# EasyEDA Pro project 调参板V3.eprj

# Schematic Schematic1
Create Date: 2024-02-26; Page Name: P1; Project Name: 调参板V3; Schematic Name: Schematic1; Update Date: 2024-02-26; Company: 嘉立创EDA; Page Size: A4; Version: V1.0
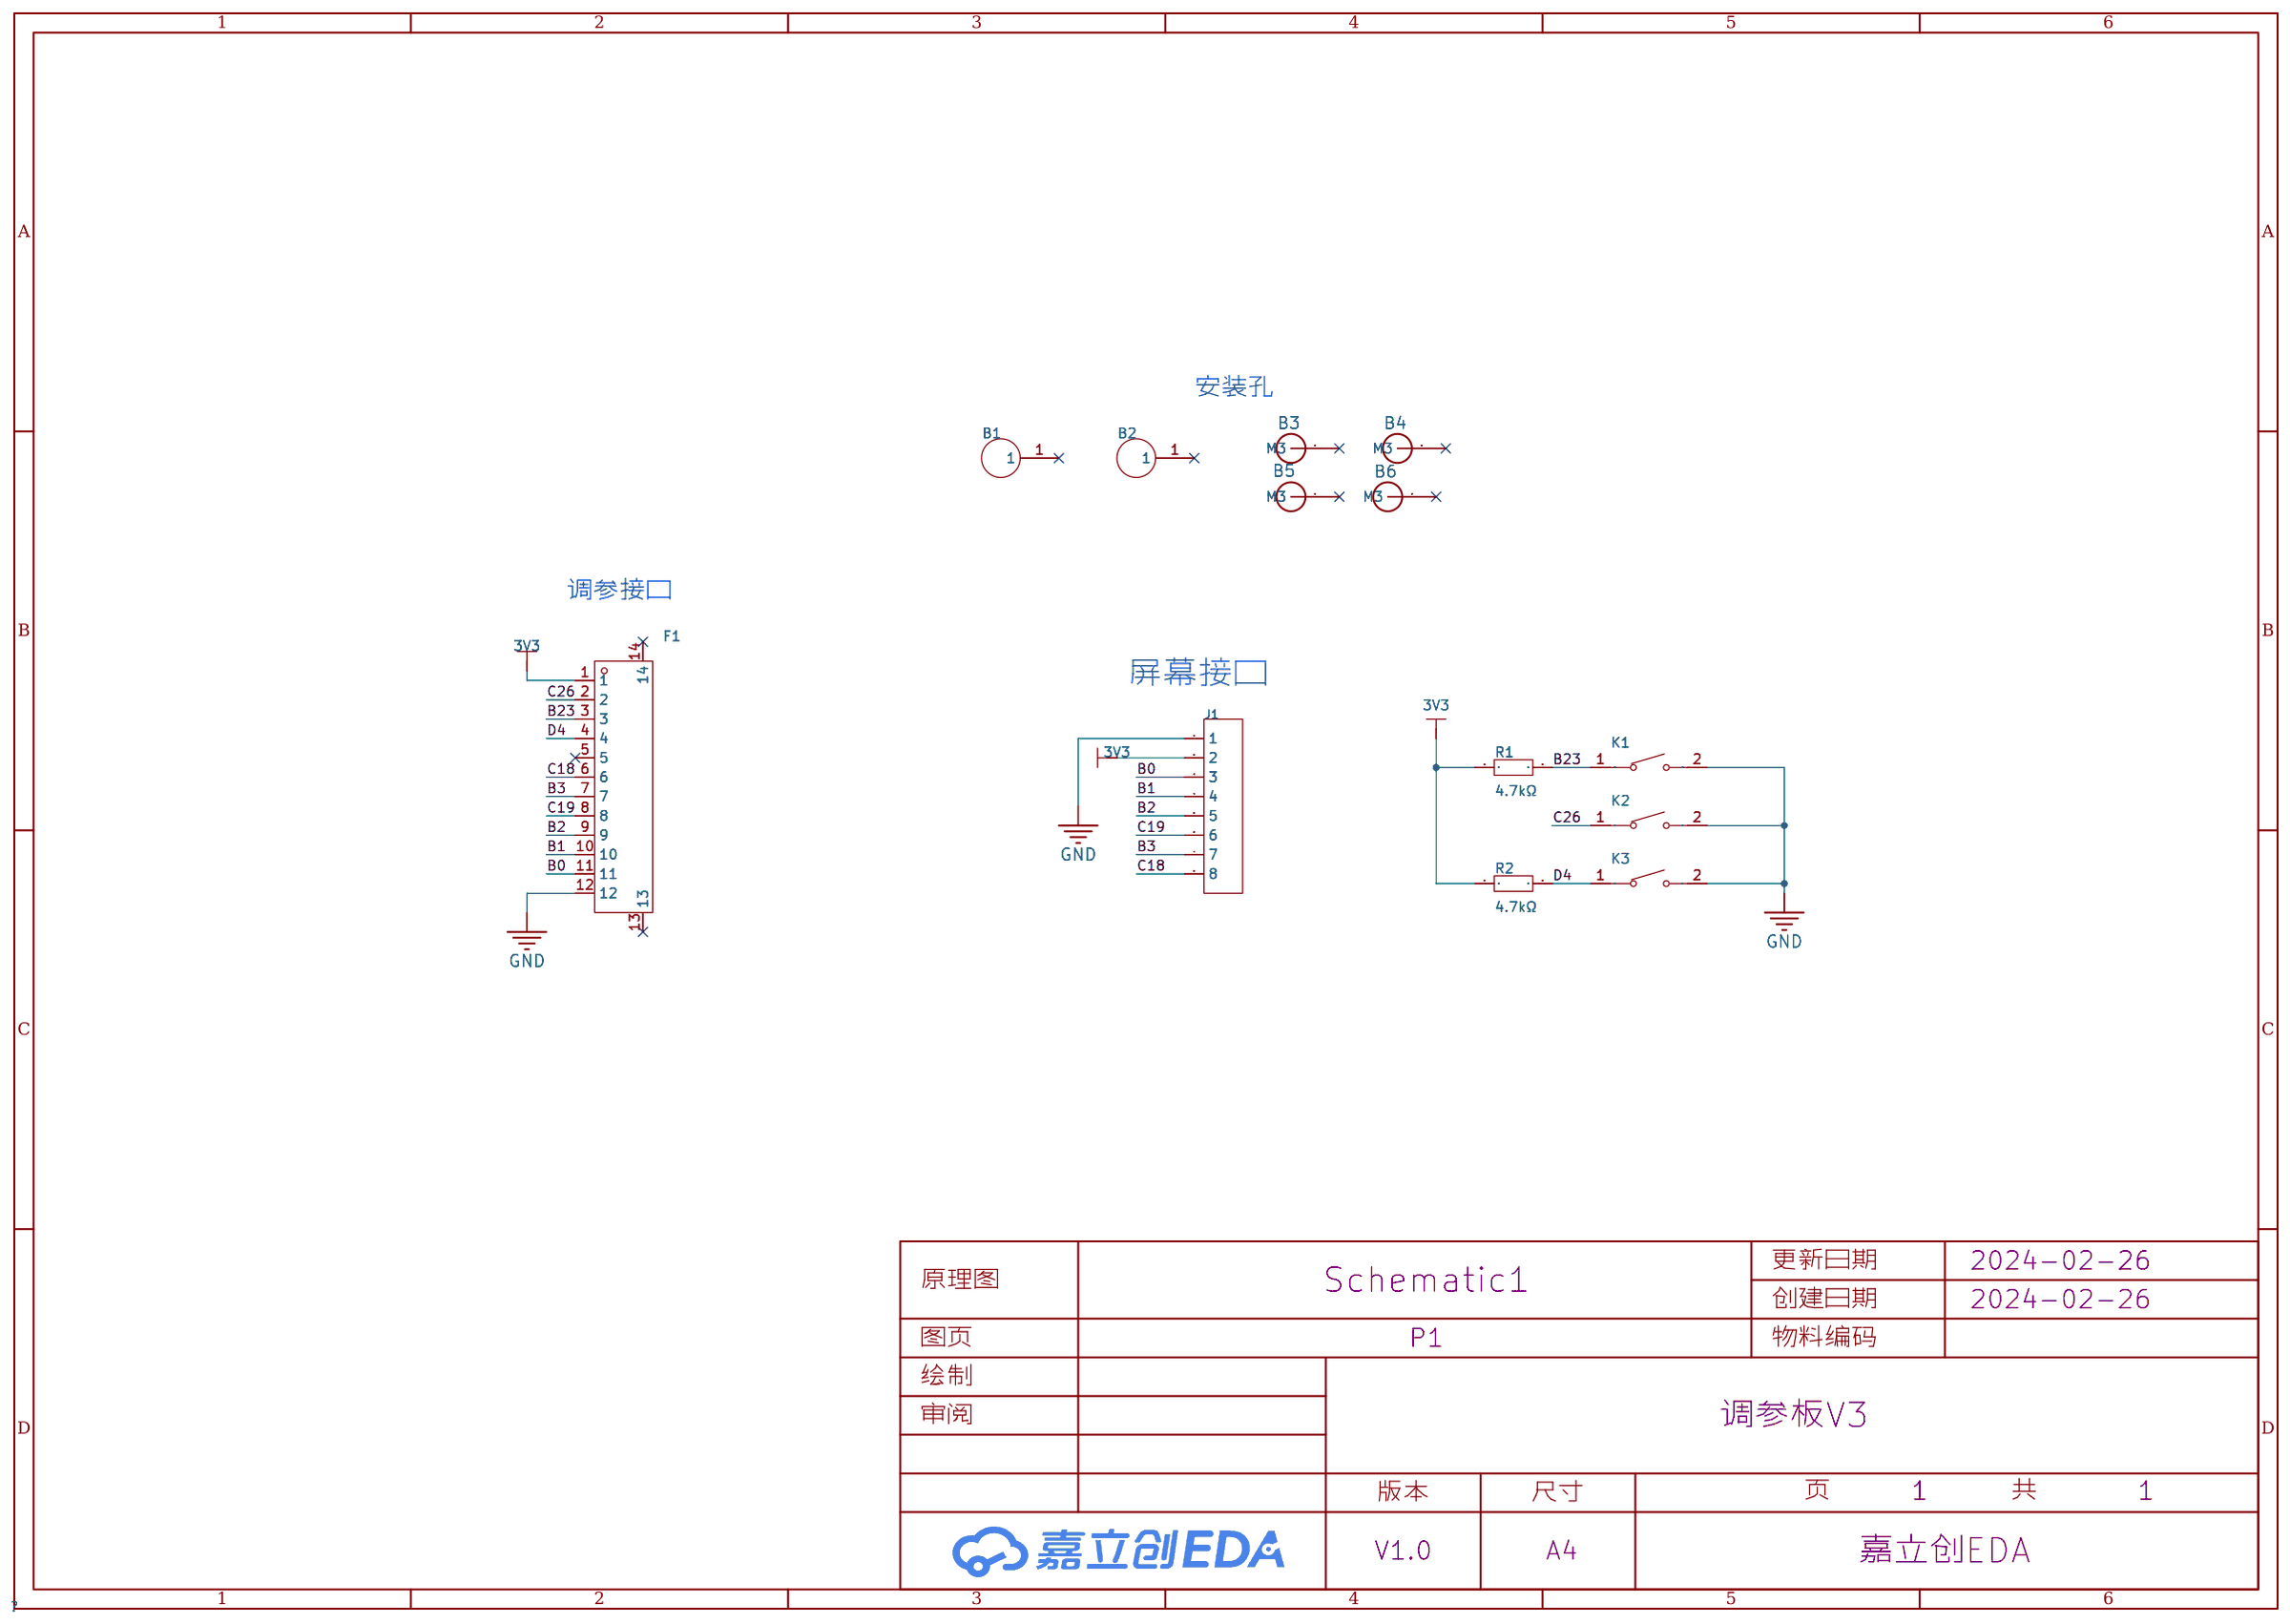
[diagram p0: schematic sheet]

## Parts
B1  -  [M2]
B2  -  [M2]
B3  M3螺柱孔_JX  [M3]
B4  M3螺柱孔_JX  [M3]
B5  M3螺柱孔_JX  [M3]
B6  M3螺柱孔_JX  [M3]
F1  FPC-1.0FX-12PWCR-H20  [FPC-SMD_XUNPU_FPC-1.0FX-12PWCR-H20]
J1  -  [HDR-TH_8P-P2.54-V-F-1]
K1  TS665WS 250gf  [SW-SMD_L6.0-W6.0-LS6.6]
K2  TS665WS 250gf  [SW-SMD_L6.0-W6.0-LS6.6]
K3  TS665WS 250gf  [SW-SMD_L6.0-W6.0-LS6.6]
R1  4.7kΩ  [R0603]
R2  4.7kΩ  [R0603]

## Library data of the parts
B1 B2 = M2
B3-B6 = M3螺柱孔_JX
F1 = FPC-1.0FX-12PWCR-H20: 锁定特性:翻盖式;触点类型:下接;触点数量:12P;间距:1mm;安装类型:卧贴;; LCSC Part Name: 间距:1mm P数:12P 翻盖式 下接; Supplier Part: C19269355; Manufacturer: XUNPU(讯普); Supplier Footprint: SMD,P=1mm,卧贴; Datasheet: https://atta.szlcsc.com/upload/public/pdf/source/20231121/46D1D420E162B395A0FFF09C3BB98E72.pdf; Supplier: LCSC; Locking Feature: 翻盖式; Contact Type: 下接; Number of Contacts: 12P; Pitch: 1mm; Mounting Type: 卧贴; Height Above Board: 2mm
J1 = HDR-F_2.54_1x8P: Supplier Part: C27438; Supplier Footprint: 插件
K1-K3 = TS665WS 250gf: 电路结构:单刀单掷;按钮形状:圆形按钮;作用力:250gf;安装方式:立贴;开关长度:6mm;开关宽度:6mm;开关高度:5mm;带支架:不带;触点电流:50mA;额定电压(DC):12V;额定功率:0.6W;绝缘电阻:100MΩ;带灯:无;机械寿命:10万次;; LCSC Part Name: 无声按键开关 6*6*5mm 250G; Supplier Part: C6798384; Manufacturer: SHOU HAN(首韩); Supplier Footprint: SMD; JLCPCB Part Class: 扩展库; Datasheet: https://atta.szlcsc.com/upload/public/pdf/source/20230621/9BA9DAAFF61506696103CF7691F2BF59.pdf; Supplier: LCSC; Circuit: 单刀单掷; Actuator Style: 圆形按钮; Operating Force: 250gf; Mounting Style: 立贴; Switch Length: 6mm; Switch Width: 6mm; Switch Height: 5mm; Strike Gundam: 不带; Contact Current: 50mA; Voltage Rating (DC): 12V; Power Rating: 0.6W; Insulation Resistance: 100MΩ; Actuator/Cap Color: 黑色; With Lamp: 无; Mechanical Life: 10万次; Operating Temperature: -40℃~+80℃
R1 R2 = 0603WAF4701T5E: 电阻类型:厚膜电阻;阻值:4.7kΩ;精度:±1%;功率:100mW;最大工作电压:75V;温度系数:±100ppm/℃;; LCSC Part Name: 4.7kΩ ±1% 100mW 厚膜电阻; Supplier Part: C23162; Manufacturer: UNI-ROYAL(厚声); Supplier Footprint: 0603; JLCPCB Part Class: 基础库; Datasheet: https://atta.szlcsc.com/upload/public/pdf/source/20200306/C422600_1E6D84923E4A46A82E41ADD87F860B5C.pdf; Supplier: LCSC; Type: 厚膜电阻; Tolerance: ±1%; Power(Watts): 100mW; Overload Voltage (Max): 75V; Temperature Coefficient: ±100ppm/℃; Operating Temperature Range: -55℃~+155℃

## Nets
3V3: F1.1 J1.2 R1.1 R2.1
GND: F1.12 J1.1 K1.2(B) K2.2(B) K3.2(B)
B0: F1.11 J1.3
B1: F1.10 J1.4
B2: F1.9 J1.5
B3: F1.7 J1.7
B23: F1.3 K1.1(A) R1.2
C18: F1.6 J1.8
C19: F1.8 J1.6
C26: F1.2 K2.1(A)
D4: F1.4 K3.1(A) R2.2

Not connected (* = marked no-connect by the designer): B1 1*; B2 1*; B3 1(M3)*; B4 1(M3)*; B5 1(M3)*; B6 1(M3)*; F1 5* 13* 14*

## Notes on the sheet
- 安装孔
- 调参接口
- 屏幕接口

# Board PCB1
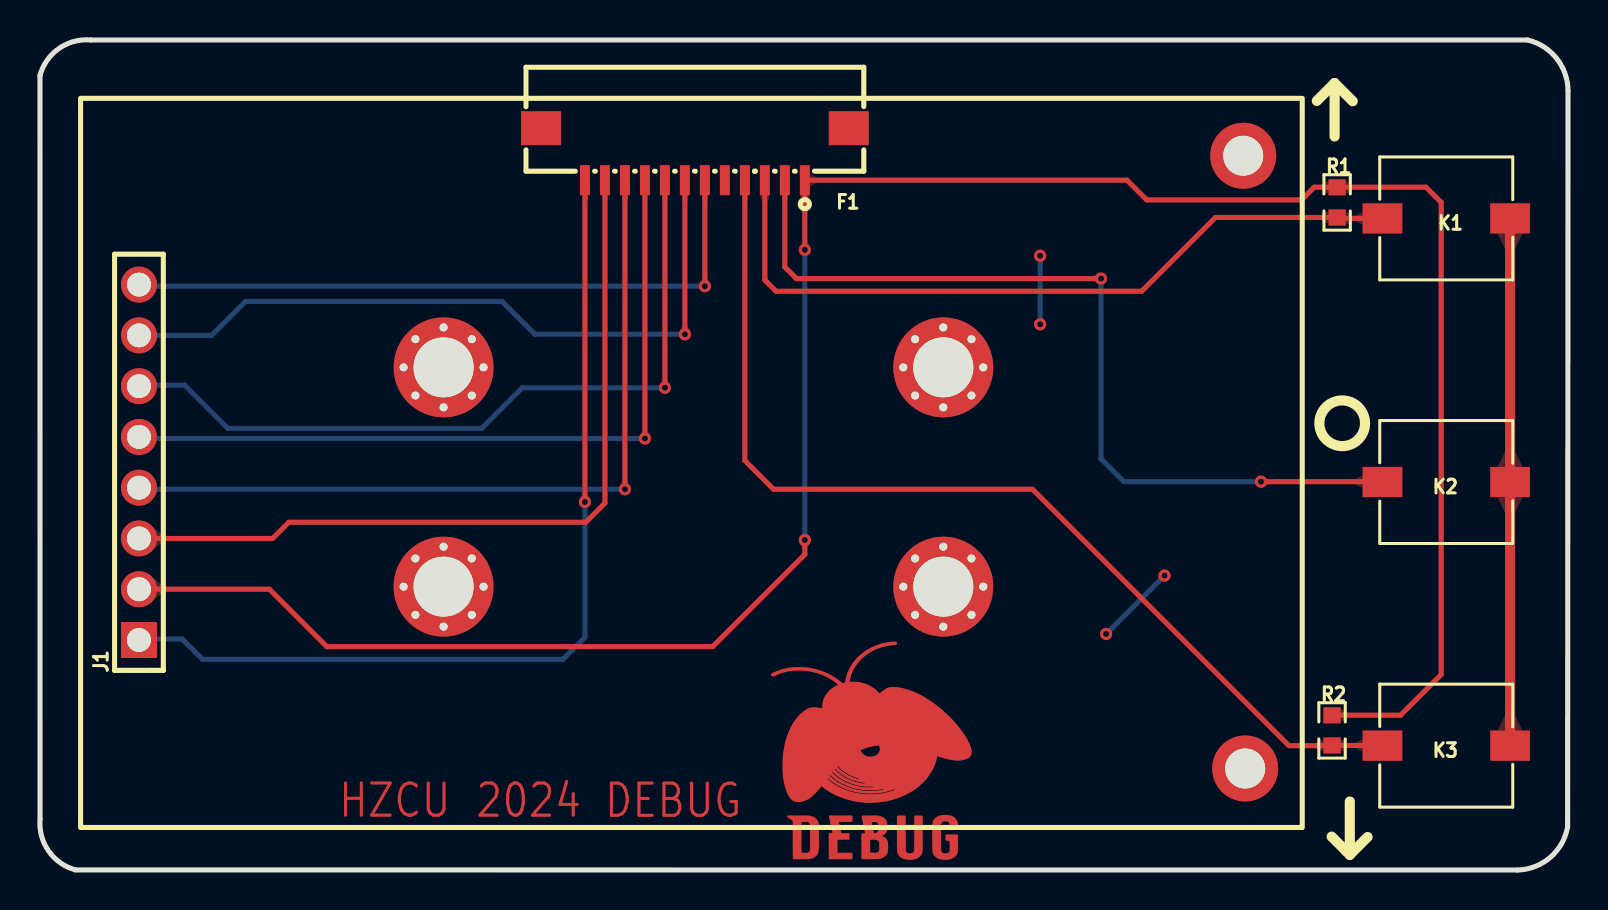
[diagram p1: board, top side]
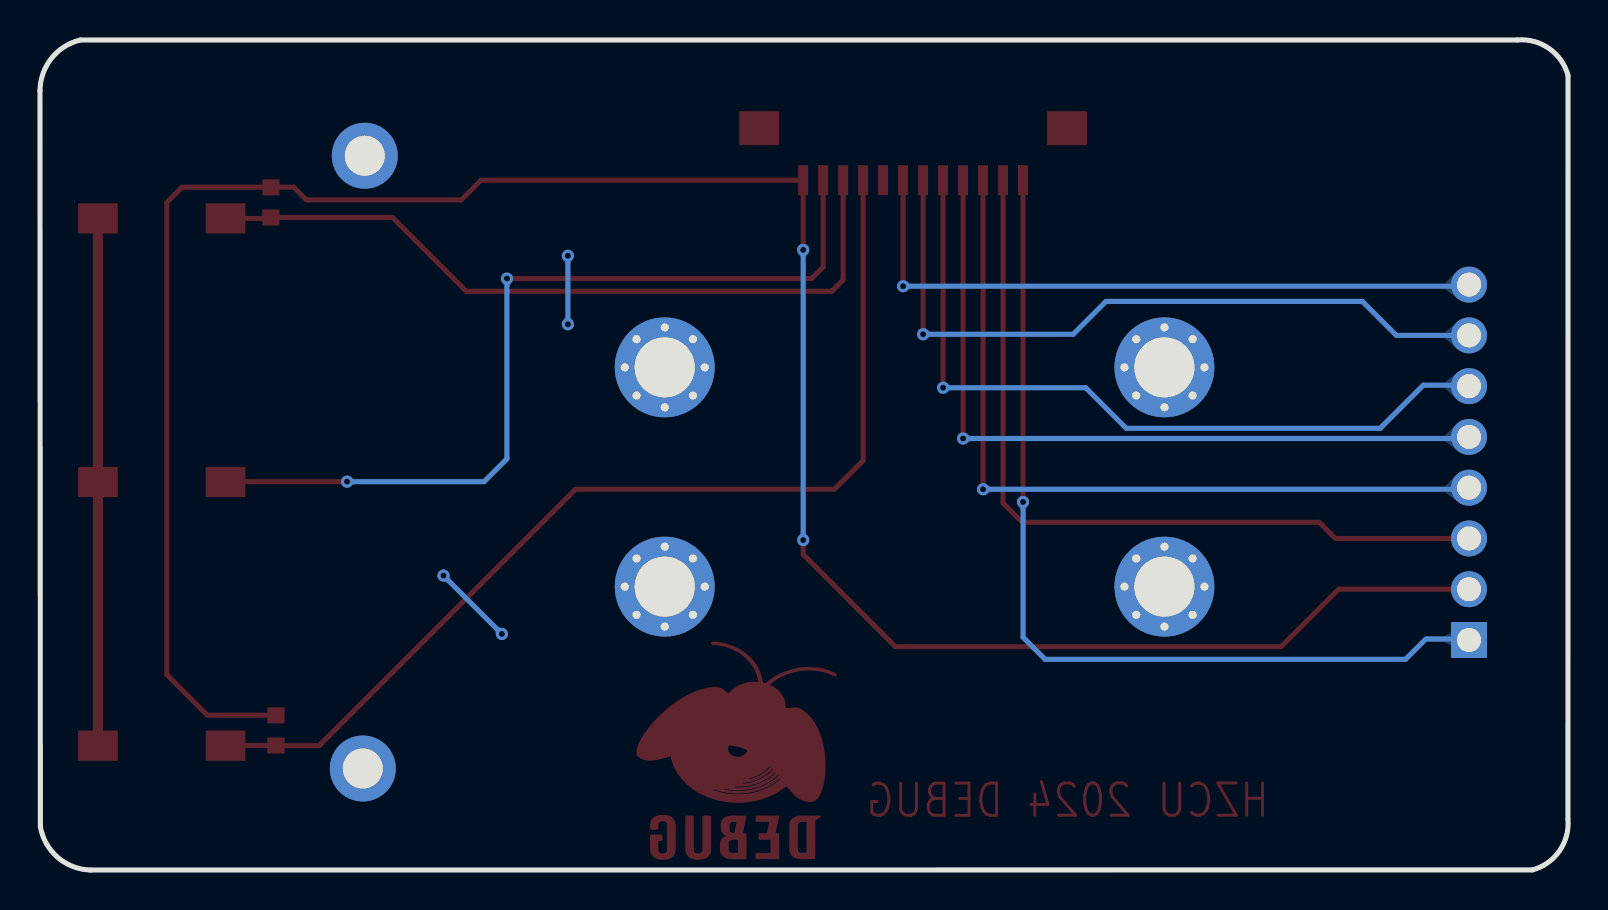
[diagram p2: board, bottom side, seen from below]

Outline 76.45 x 41.53 mm; copper layers: Top Layer, Bottom Layer. Coordinates in mm from the lower left corner of the outline.
Outline path: 0,39.75 0,2.54 arc(0.43,0.95) 1.78,0 73.91,0 arc(75.56,0.63) 76.43,2.17 76.45,38.99 arc(75.88,40.61) 74.42,41.53 2.54,41.53 arc(0.95,41.1) 0,39.75
Stack: Top Layer 0.035mm / Dielectric1 1.51mm FR4 er 4.5 / Bottom Layer 0.035mm

## Design rules (mm)
template: JLCPCB Capability(Two Layers Board)
spacing copperThickness1oz (default): track to track 0.102, other pairs 0.152 to 0.3
spacing copperThickness2oz: track to track 0.203, other pairs 0.152 to 0.3
track width copperThickness1oz (default): min 0.127, default 0.254, max 2.54
track width copperThickness2oz: min 0.203, default 0.254, max 2.54
differential pair differentialPair (default): width min 0.127, default 0.254, max 2.54; gap min 0.152, default 0.152
via viaSize (default): diameter min 0.5, default 0.61, max 10; hole min 0.3, default 0.305, max 6.3

## Placement (name value [footprint] x y rotation side)
B1  -  [M2]  60.3 5.08 0 top
B2  -  [M2]  60.2 35.74 0 top
B3  M3螺柱孔_JX  [M3]  20.19 25.15 0 top
B4  M3螺柱孔_JX  [M3]  45.19 25.15 0 top
B5  M3螺柱孔_JX  [M3]  20.19 14.18 0 top
B6  M3螺柱孔_JX  [M3]  45.19 14.18 0 top
F1  FPC-1.0FX-12PWCR-H20  [FPC-SMD_XUNPU_FPC-1.0FX-12PWCR-H20]  32.77 35.81 180 top
J1  -  [HDR-TH_8P-P2.54-V-F-1]  4.95 20.4 90 top
K1  TS665WS 250gf  [SW-SMD_L6.0-W6.0-LS6.6]  70.36 32.6 0 top
K2  TS665WS 250gf  [SW-SMD_L6.0-W6.0-LS6.6]  70.36 19.41 0 top
K3  TS665WS 250gf  [SW-SMD_L6.0-W6.0-LS6.6]  70.36 6.22 0 top
R1  4.7kΩ  [R0603]  64.9 33.4 270 top
R2  4.7kΩ  [R0603]  64.64 6.98 270 top

## Footprints (pads in the part's own frame, mm; a bottom-side part is the same pattern mirrored in y, then rotated)
FPC-SMD_XUNPU_FPC-1.0FX-12PWCR-H20
  rect 0.5x1.5 smd: 1(-5.5,1.3) 2(-4.5,1.3) 3(-3.5,1.3) 4(-2.5,1.3) 5(-1.5,1.3) 6(-0.5,1.3) 7(0.5,1.3) 8(1.5,1.3) 9(2.5,1.3) 10(3.5,1.3) 11(4.5,1.3) 12(5.5,1.3)
  rect 2x1.7 smd: 13(7.7,-1.3) 14(-7.7,-1.3)
HDR-TH_8P-P2.54-V-F-1
  rect 1.8x1.8 hole 1.2: 1(-8.89,0)
  round 1.8 hole 1.2: 2(-6.35,0) 3(-3.81,0) 4(-1.27,0) 5(1.27,0) 6(3.81,0) 7(6.35,0) 8(8.89,0)
M2
  round 3.3 hole 2: 1(0,0)
M3
  round 0.6 hole 0.405x0.4: 1(-2,0) 1(-1.41,1.409) 1(-1.41,-1.41) 1(0,2) 1(0,-2) 1(1.41,1.409) 1(1.41,-1.41) 1(2,0)
  round 5 hole 3.005x3: 1(0,0)
R0603
  rect 0.806x0.864 smd: 1(-0.753,0) 2(0.753,0)
SW-SMD_L6.0-W6.0-LS6.6
  rect 1.985x1.512 smd: 1(-3.192,0) 2(3.192,0)

## Nets
As in the schematic.

Pads without a net: B1 1; B2 1; B3 1; B4 1; B5 1; B6 1; F1 5 13 14

## Via types
v1: diameter 0.61, hole 0.305, Top Layer to Bottom Layer, 14 vias

## Routing (per net, layer and track width the routed paths; a pad name or vN(x,y) marks a point on that pad's centre or on a via; arc(x,y) is an arc through that point)
3V3: length 117.9
  Top Layer w0.254: v1(38.27,31.03) F1.1 54.39,34.51 55.37,33.53 63.12,33.53 63.75,34.16 64.89,34.16 ; R2.1 64.65,7.75 68.07,7.75 70.1,9.78 70.1,33.4 69.34,34.16 64.89,34.16 ; 64.89,34.16 R1.1 ; v1(38.27,16.51) 38.27,15.79 33.65,11.18 14.35,11.18 11.48,14.05 J1.2
  Bottom Layer w0.254: v1(38.27,31.03) v1(38.27,16.51)
GND: length 80
  Top Layer w0.254: F1.12 v1(27.27,18.42)
  Top Layer w0.508: K1.2 K2.2 K3.2
  Bottom Layer w0.254: v1(50.04,27.31) v1(50.04,30.73) ; J1.1 5,11.56 7.11,11.56 8.13,10.54 26.16,10.54 27.27,11.64 v1(27.27,18.42) ; v1(53.34,11.81) v1(56.26,14.73)
B0: length 40.2
  Top Layer w0.254: J1.3 11.64,16.59 12.45,17.4 27.3,17.4 28.27,18.36 F1.11
B1: length 39.8
  Top Layer w0.254: F1.10 v1(29.27,19.05)
  Bottom Layer w0.254: v1(29.27,19.05) 5.03,19.05 J1.4
B2: length 38.3
  Top Layer w0.254: F1.9 v1(30.27,21.59)
  Bottom Layer w0.254: J1.5 5.03,21.59 v1(30.27,21.59)
B3: length 36.4
  Top Layer w0.254: F1.7 v1(32.27,26.81)
  Bottom Layer w0.254: J1.7 8.59,26.75 10.29,28.45 23.11,28.45 24.76,26.81 v1(32.27,26.81)
B23: length 37.7
  Top Layer w0.254: F1.3 36.27,29.52 36.83,28.96 55.12,28.96 58.81,32.65 R1.2 64.94,32.6 K1.1
C18: length 33.6
  Top Layer w0.254: F1.6 v1(33.27,29.21)
  Bottom Layer w0.254: J1.8 5.03,29.21 v1(33.27,29.21)
C19: length 38.5
  Top Layer w0.254: F1.8 v1(31.27,24.13)
  Bottom Layer w0.254: J1.6 5,24.26 7.24,24.26 9.4,22.1 22.1,22.1 24.13,24.13 v1(31.27,24.13)
C26: length 44
  Top Layer w0.254: v1(53.09,29.59) 37.85,29.59 37.27,30.17 F1.2 ; K2.1 67.15,19.43 v1(61.09,19.43)
  Bottom Layer w0.254: v1(61.09,19.43) 54.23,19.43 53.09,20.57 v1(53.09,29.59)
D4: length 51.8
  Top Layer w0.254: K3.1 67.16,6.23 R2.2 64.63,6.22 62.48,6.22 49.66,19.05 36.7,19.05 35.27,20.49 F1.4

## Copper pours and planes (outline as drawn; the poured copper is in the pictures)
GND on Top Layer: -8.89,52.96 82.42,52.96 82.42,-8.64 -8.89,-8.64
GND on Bottom Layer: -9.27,53.34 82.55,53.34 82.55,-8.38 -9.02,-8.38 -9.27,-8.13

Small or netless copper shapes (teardrops, artwork), in the pictures only: 44 on Top Layer, 20 on Bottom Layer

## Text on the board
Top Layer: HZCU | 2024 | DEBUG
Top Solder Mask Layer: HZCU | 2024 | DEBUG
